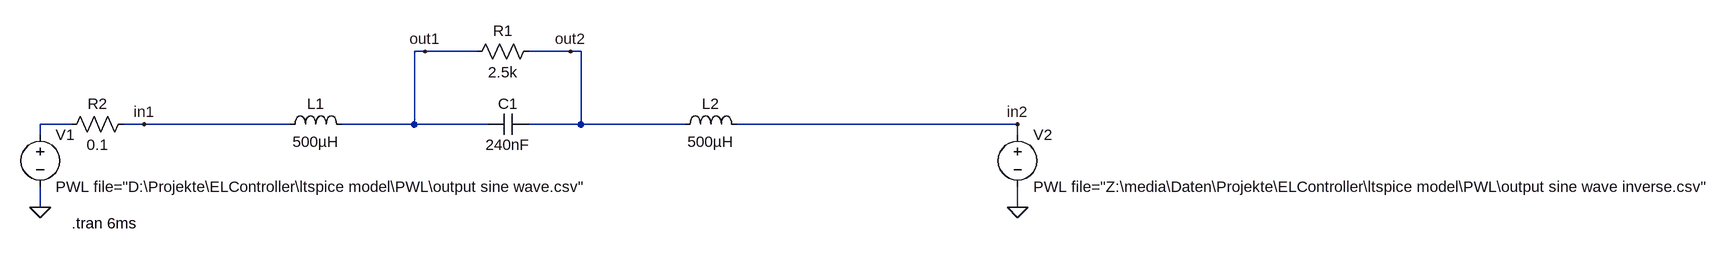
[diagram p0: schematic Filter Test R2.asc]
Filter Test R2.asc, the LTspice schematic file:
Version 4
SHEET 1 2240 680
WIRE 128 -32 112 -32
WIRE 208 -32 128 -32
WIRE 352 -32 288 -32
WIRE 368 -32 352 -32
WIRE -416 80 -464 80
WIRE -304 80 -336 80
WIRE -80 80 -304 80
WIRE 112 80 112 -32
WIRE 112 80 0 80
WIRE 224 80 112 80
WIRE 368 80 368 -32
WIRE 368 80 288 80
WIRE 528 80 368 80
WIRE 1040 80 608 80
WIRE -464 96 -464 80
WIRE 1040 96 1040 80
WIRE -464 208 -464 176
WIRE 1040 208 1040 176
FLAG 1040 208 0
FLAG -464 208 0
FLAG 128 -32 out1
FLAG 352 -32 out2
FLAG -304 80 in1
FLAG 1040 80 in2
SYMBOL voltage -464 80 R0
WINDOW 123 0 0 Left 0
WINDOW 39 0 0 Left 0
SYMATTR InstName V1
SYMATTR Value PWL file="D:\Projekte\ELController\ltspice model\PWL\output sine wave.csv"
SYMBOL cap 288 64 R90
WINDOW 0 0 32 VBottom 2
WINDOW 3 32 32 VTop 2
SYMATTR InstName C1
SYMATTR Value 240nF
SYMBOL voltage 1040 80 R0
WINDOW 123 0 0 Left 0
WINDOW 39 0 0 Left 0
SYMATTR InstName V2
SYMATTR Value PWL file="Z:\media\Daten\Projekte\ELController\ltspice model\PWL\output sine wave inverse.csv"
SYMBOL ind -96 96 R270
WINDOW 0 32 56 VTop 2
WINDOW 3 5 56 VBottom 2
SYMATTR InstName L1
SYMATTR Value 500µH
SYMBOL ind 512 96 R270
WINDOW 0 32 56 VTop 2
WINDOW 3 5 56 VBottom 2
SYMATTR InstName L2
SYMATTR Value 500µH
SYMBOL res 304 -48 R90
WINDOW 0 0 56 VBottom 2
WINDOW 3 32 56 VTop 2
SYMATTR InstName R1
SYMATTR Value 2.5k
SYMBOL res -320 64 R90
WINDOW 0 0 56 VBottom 2
WINDOW 3 32 56 VTop 2
SYMATTR InstName R2
SYMATTR Value 0.1
TEXT -416 232 Left 2 !.tran 6ms

The netlist it stands for:
* Filter Test R2.asc
V1 N001 0 PWL file="D:\Projekte\ELController\ltspice model\PWL\output sine wave.csv"
C1 out2 out1 240nF
V2 in2 0 PWL file="Z:\media\Daten\Projekte\ELController\ltspice model\PWL\output sine wave inverse.csv"
L1 in1 out1 500µH
L2 out2 in2 500µH
R1 out2 out1 2.5k
R2 in1 N001 0.1
.tran 6ms
.backanno
.end